# EAGLE design pilot (EAGLE 9.6.2)
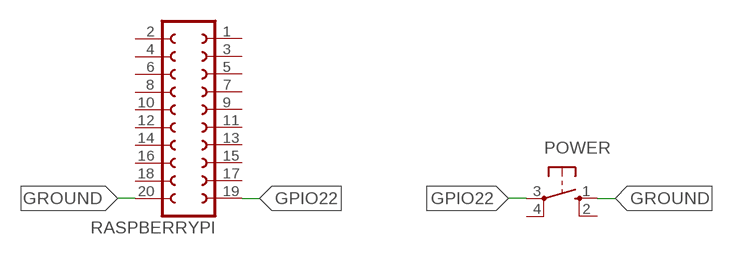
[diagram p0: schematic, sheet 1]

## Parts
POWER  10-XX  [B3F-10XX]
RASPBERRYPI  FE10-2  [FE10-2]

## Nets
GPIO22: POWER.3(P) RASPBERRYPI.19
GROUND: POWER.1(S) RASPBERRYPI.20
Unconnected: POWER.2(S1) POWER.4(P1) RASPBERRYPI.1 RASPBERRYPI.2 RASPBERRYPI.3 RASPBERRYPI.4 RASPBERRYPI.5 RASPBERRYPI.6 RASPBERRYPI.7 RASPBERRYPI.8 RASPBERRYPI.9 RASPBERRYPI.10 RASPBERRYPI.11 RASPBERRYPI.12 RASPBERRYPI.13 RASPBERRYPI.14 RASPBERRYPI.15 RASPBERRYPI.16 RASPBERRYPI.17 RASPBERRYPI.18

## Library data of the parts
POWER = switch-omron:10-XX: OMRON SWITCH; MPN: B3F-1000; OC_FARNELL: 176432; OC_NEWARK: 36M3542
RASPBERRYPI = con-lsta:FE10-2: FEMALE HEADER; OC_FARNELL: unknown; OC_NEWARK: unknown

## Board
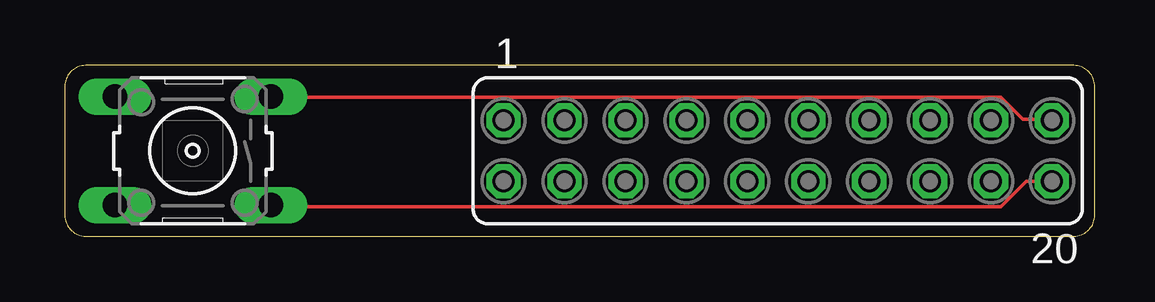
[diagram p1: board, top side]

Size 42.93 x 7.11 mm. Coordinates in mm from the lower left corner, seen from the top.
Outline: 0.87,0 42.05,0 arc90 42.93,0.88 42.93,6.24 arc90 42.05,7.11 0.87,7.11 arc90 0,6.25 0,0.87 arc90 0.87,0
Copper layers (1*16): Top 0.035mm / dielectric 1.5mm / Bottom 0.035mm
Design rules "default": minimum track width 6mil, minimum drill 0.35mm, track to track 6mil, track to pad 6mil, pad to pad 6mil, via to via 6mil, smd to smd 6mil, copper to edge 40mil, drill to drill 6mil, minimum pad ring 10mil, minimum via ring 8mil, stop-mask expansion 4mil, vias tented up to drill 0mil, thermal gap 10mil

### Footprints (pad centres in the part's own frame; a part is rotated, then mirrored left to right if it is on the bottom)
B3F-10XX = drill 1.016 long: 1 -3.251,2.261; 2 3.251,2.261; 3 -3.251,-2.261; 4 3.251,-2.261
FE10-2 = drill 0.914 octagon: 1 -11.43,1.27; 2 -11.43,-1.27; 3 -8.89,1.27; 4 -8.89,-1.27; 5 -6.35,1.27; 6 -6.35,-1.27; 7 -3.81,1.27; 8 -3.81,-1.27; 9 -1.27,1.27; 10 -1.27,-1.27; 11 1.27,1.27; 12 1.27,-1.27; 13 3.81,1.27; 14 3.81,-1.27; 15 6.35,1.27; 16 6.35,-1.27; 17 8.89,1.27; 18 8.89,-1.27; 19 11.43,1.27; 20 11.43,-1.27

### Placement (x,y rotation side)
POWER  5.33,3.56 180 top
RASPBERRYPI  29.72,3.56 0 top

### Tracks (layer width: path | path; a pad name or v marks a point on that pad's centre or on a via)
GPIO22
  Top 0.152: RASPBERRYPI.19 41.15,4.88 39.93,4.88 39.01,5.79 8.69,5.79 POWER.3
GROUND
  Top 0.152: RASPBERRYPI.20 40.08,2.29 39.01,1.22 8.69,1.22 POWER.1